# EAGLE schematic Haar_Primal (EAGLE 9.6.2)
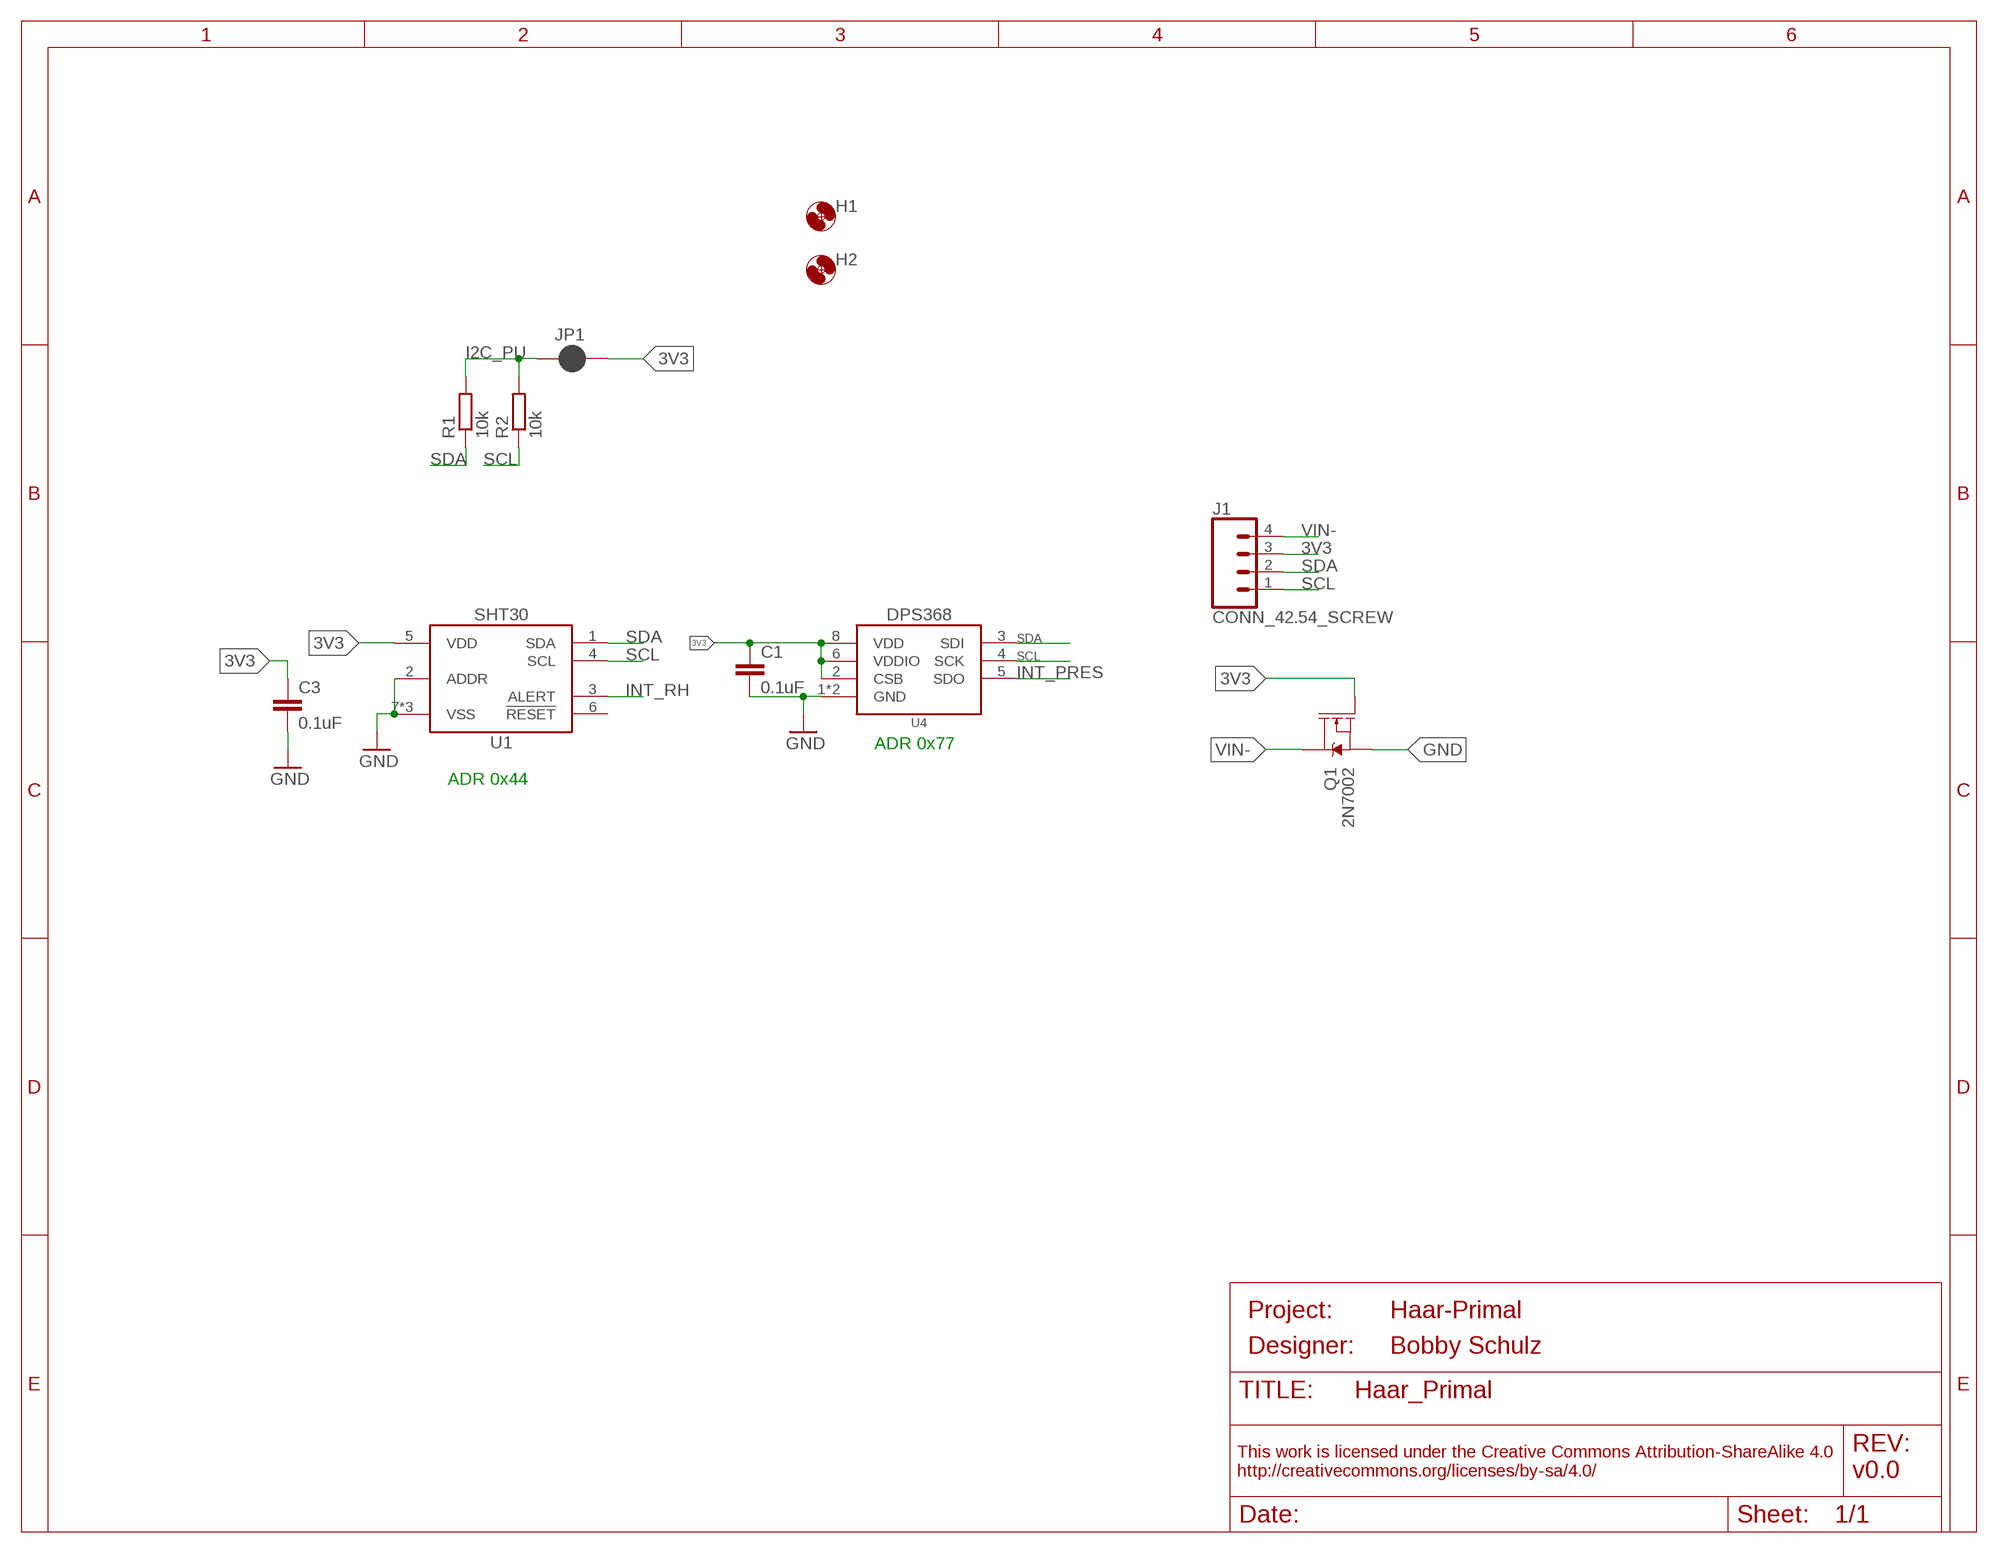
[diagram p0: schematic, sheet 1]
FRAME1 (FRAME_A_L): DESIGNER: Bobby Schulz; PROJECT: Haar-Primal; REV: v0.0

## Parts
C1  0.1uF  C-EU0.1UFC0603  [C0603]
C3  0.1uF  C-EU0.1UFC0603  [C0603]
H1  MOUNTING_HOLE2_NP  [2_56]
H2  MOUNTING_HOLE2_NP  [2_56]
J1  CONN_42.54_SCREW  [1X04_SCREW]
JP1  JUMPER-SMT_2_NC_PASTE_SILK  [SMT-JUMPER_2_NC_PASTE_SILK]
Q1  2N7002  MOSFET-NCH-2N7002PW  [SOT323]
R1  10k  R-EU_10KR0603  [R0603]
R2  10k  R-EU_10KR0603  [R0603]
U1  SHT30DFN  [DFN_8_2.5X2.5]
U4  DPS368  [PG-VLGA-8]

## Nets
3V3: C1.1 C3.1 J1.3 JP1.2 Q1.1(G) U1.5(VDD) U4.2(CSB) U4.6(VDDIO) U4.8(VDD)
GND: C1.2 C3.2 Q1.2(S) U1.2(ADDR) U1.7(VSS) U1.8(VSS) U1.EP(VSS) U4.1(GND) U4.7(GND)
I2C_PU: JP1.1 R1.2 R2.2
INT_PRES: U4.5(SDO)
INT_RH: U1.3(ALERT)
SCL: J1.1 R2.1 U1.4(SCL) U4.4(SCK)
SDA: J1.2 R1.1 U1.1(SDA) U4.3(SDI)
VIN-: J1.4 Q1.3(D)
Unconnected: U1.6(!RESET)

## Notes on the sheet
- ADR 0x77
- ADR 0x44

## Library data of the parts
C1 C3 = bschulz_passives:C-EU: CAPACITOR, European symbol; DIGIKEY: 490-6051-1-ND; MF: Murata; MPN: GCM188R71E104KA57D
H1 H2 = bschulz:MOUNTING_HOLE: Genaric Mechanical Mounting Hole Hole diameter based on max body diameter + 15% Keepout ring is for diameter of socket cap screw (minimum required clearance) TPlace ring is for diameter of pan head screw (recomended clearance) Specifications: Socket Cap <http://fastener-express.com/fastener-technical/SocketscapSS-Alloy.pdf> Button Head Socket Cap <http://fastener-express.com/fastener-technical/Button-Socket-alloy.pdf> Pan Head <http://fastener-express.com/fastener-technical/pan-machine-Screws.pdf>
J1 = bschulz:CONN_4: Genaric 4 terminal header Digikey 2.54_SCREW <https://www.digikey.com/product-detail/en/on-shore-technology-inc/OSTVN04A150/ED10563-ND/1588864>; DIGIKEY: ED10563-ND; MF: On Shore; MPN: OSTVN04A150
JP1 = SparkFun-Jumpers:JUMPER-SMT_2_NC_PASTE: Normally closed solder jumper This jumper has an aperture in the stencil to allow solder paste to bridge the split in the wire so it's normally closed (NC). Wick off the solder to open the connection. Reapply solder to reclose the connection.
Q1 = bschulz:MOSFET-NCH: N-channel MOSFETs Voltage controlled devices that allow control of high current outputs. SparkFun Products: SparkFun OpenScale <https://www.sparkfun.com/products/13261> SparkFun Digital Sandbox <https://www.sparkfun.com/products/12651> SparkFun Monster Moto Shield <https://www.sparkfun.com/products/10182> SparkFun MOSFET Power Controller <https://www.sparkfun.com/products/11214>; DIGIKEY: 2N7002W-FDICT-ND; MF: Diodes Incorporated; MPN: 2N7002W-7-F; PROD_ID: TRANS-11151
R1 R2 = bschulz_passives:R-EU_: RESISTOR, European symbol Digikey Parts: Yageo, 0402 <https://www.digikey.com/products/en/resistors/chip-resistor-surface-mount/52?k=&pkeyword=&sv=0&s=4356&sf=1&FV=-1%7C13%2C7%7C2%2C1291%7C39157%2C1989%7C0%2C-8%7C52%2C3%7C1131%2C3%7C2503&quantity=&ColumnSort=0&page=1&stock=1&pageSize=25> Yageo, 0603 <https://www.digikey.com/products/en/resistors/chip-resistor-surface-mount/52?k=&pkeyword=&sv=0&pv1291=39245&sf=1&FV=-5%7C4356%2C-5%7C47360%2C-8%7C52%2C-1%7C13%2C7%7C2%2C1989%7C0&quantity=10&ColumnSort=1000011&page=1&stock=1&pageSize=25> Panasonic, 0603 <https://www.digikey.com/products/en/resistors/chip-resistor-surface-mount/52?k=&pkeyword=&pv252=68&sf=0&FV=ffec373d%2C1c0002%2C142c040c%2C1f140000%2Cffe00034%2C80002%2Cc0001&quantity=&ColumnSort=0&page=1&stock=1&pageSize=25> Panasonic, precision, 0603 <https://www.digikey.com/products/en/resistors/chip-resistor-surface-mount/52?FV=ffec4907%2Cfffc000a%2Cc0172%2C142c040c%2C1f140000%2Cffe00034%2C1c0002&quantity=100&ColumnSort=2085&page=1&stock=1&pageSize=25> Panasonic, 0805 <https://www.digikey.com/products/en/resistors/chip-resistor-surface-mount/52?k=&pkeyword=&pv3=1&sf=0&FV=ffec373d%2C1c0002%2C1f140000%2Cffe00034%2C142c040d&quantity=&ColumnSort=0&page=1&stock=1&pageSize=25> Rohm, current sense <https://www.digikey.com/products/en/resistors/chip-resistor-surface-mount/52?k=&pkeyword=&pv3=1&sf=0&FV=ffecb688%2C1f140000%2Cffe00034%2C1c0002&quantity=&ColumnSort=0&page=1&stock=1&pageSize=25> Vishay, pulse proof automotive <https://www.digikey.com/products/en/resistors/chip-resistor-surface-mount/52?k=&pkeyword=&pv7=2&sf=0&FV=ffec5d6b%2Cffe00034%2C1f140000&quantity=&ColumnSort=0&page=1&stock=1&pageSize=25>; DIGIKEY: 311-10.0KHRCT-ND; MF: Yageo; MPN: RC0603FR-0710KL; VALUE_PART: 10k
U1 = bschulz:SHT3*: SHT3x - Digital Humidity and Temperature Sensor Characteristics (for SHT35): Vcc: 2.15V ~ 5.5V Humidity Resolution: 0.01% RH Humidity Accuracy: ±1.5% RH Temperature Resolution: 0.01°C Temperature Accuracy: 0.1°C Operating Temperature: -40°C to 125°C Digikey: 1649-1065-1-ND (SHT30) <https://www.digikey.com/product-detail/en/sensirion-ag/SHT30-DIS-F2.5KS/1649-1065-1-ND/6212136> 1649-1066-1-ND (SHT31) <https://www.digikey.com/product-detail/en/sensirion-ag/SHT31-DIS-F2.5KS/1649-1066-1-ND/6212137> 1649-1067-1-ND (SHT35) <https://www.digikey.com/product-detail/en/sensirion-ag/SHT35-DIS-F2.5KS/1649-1067-1-ND/6212138>; DIGIKEY: 1649-1065-1-ND; DISP: SHT30; MF: Sensirion; MPN: SHT30-DIS-F2.5KS
U4 = bschulz:DPS368: DPS368 - Digital Pressure Sensor Characteristics: Vcc: 1.7V ~ 3.6V Pressure Range: 300 ~ 1200 mBar Pressure Resolution: 0.002 mBar, max Pressure Accuracy: relative ±0.06 mBar, abs ± 1 mBar Temperature Resolution: 0.01°C Temperature Accuracy: 0.5°C Operating Temperature: -40°C to 85°C Digikey: DPS368XTSA1CT-ND <https://www.digikey.com/product-detail/en/DPS368XTSA1/DPS368XTSA1CT-ND/10244081/?itemSeq=300835075>; DIGIKEY: DPS368XTSA1CT-ND; DISP: DPS368; MF: Infineon; MPN: DPS368XTSA1